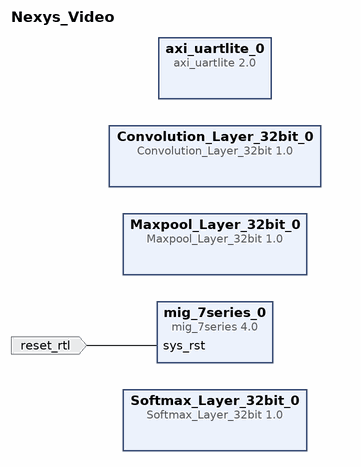
[diagram p0: block diagram of the top level]
# Vivado block design Nexys_Video, xc7a200tsbg484-1, Vivado 2016.4
create_bd_design Nexys_Video

create_bd_port -dir I -type rst reset_rtl
set_property -dict {CONFIG.POLARITY ACTIVE_LOW} [get_bd_ports reset_rtl]

create_bd_cell -type ip -vlnv xilinx.com:user:Convolution_Layer_32bit:1.0 Convolution_Layer_32bit_0
create_bd_cell -type ip -vlnv xilinx.com:user:Softmax_Layer_32bit:1.0 Softmax_Layer_32bit_0
create_bd_cell -type ip -vlnv xilinx.com:user:Maxpool_Layer_32bit:1.0 Maxpool_Layer_32bit_0
create_bd_cell -type ip -vlnv xilinx.com:ip:mig_7series:4.0 mig_7series_0
create_bd_cell -type ip -vlnv xilinx.com:ip:axi_uartlite:2.0 axi_uartlite_0

# ---- connections ----

connect_bd_net [get_bd_ports reset_rtl] [get_bd_pins mig_7series_0/sys_rst]

validate_bd_design
save_bd_design
